# Altium schematic sheet V_Sns_I2C_Isolators.SchDoc
size B
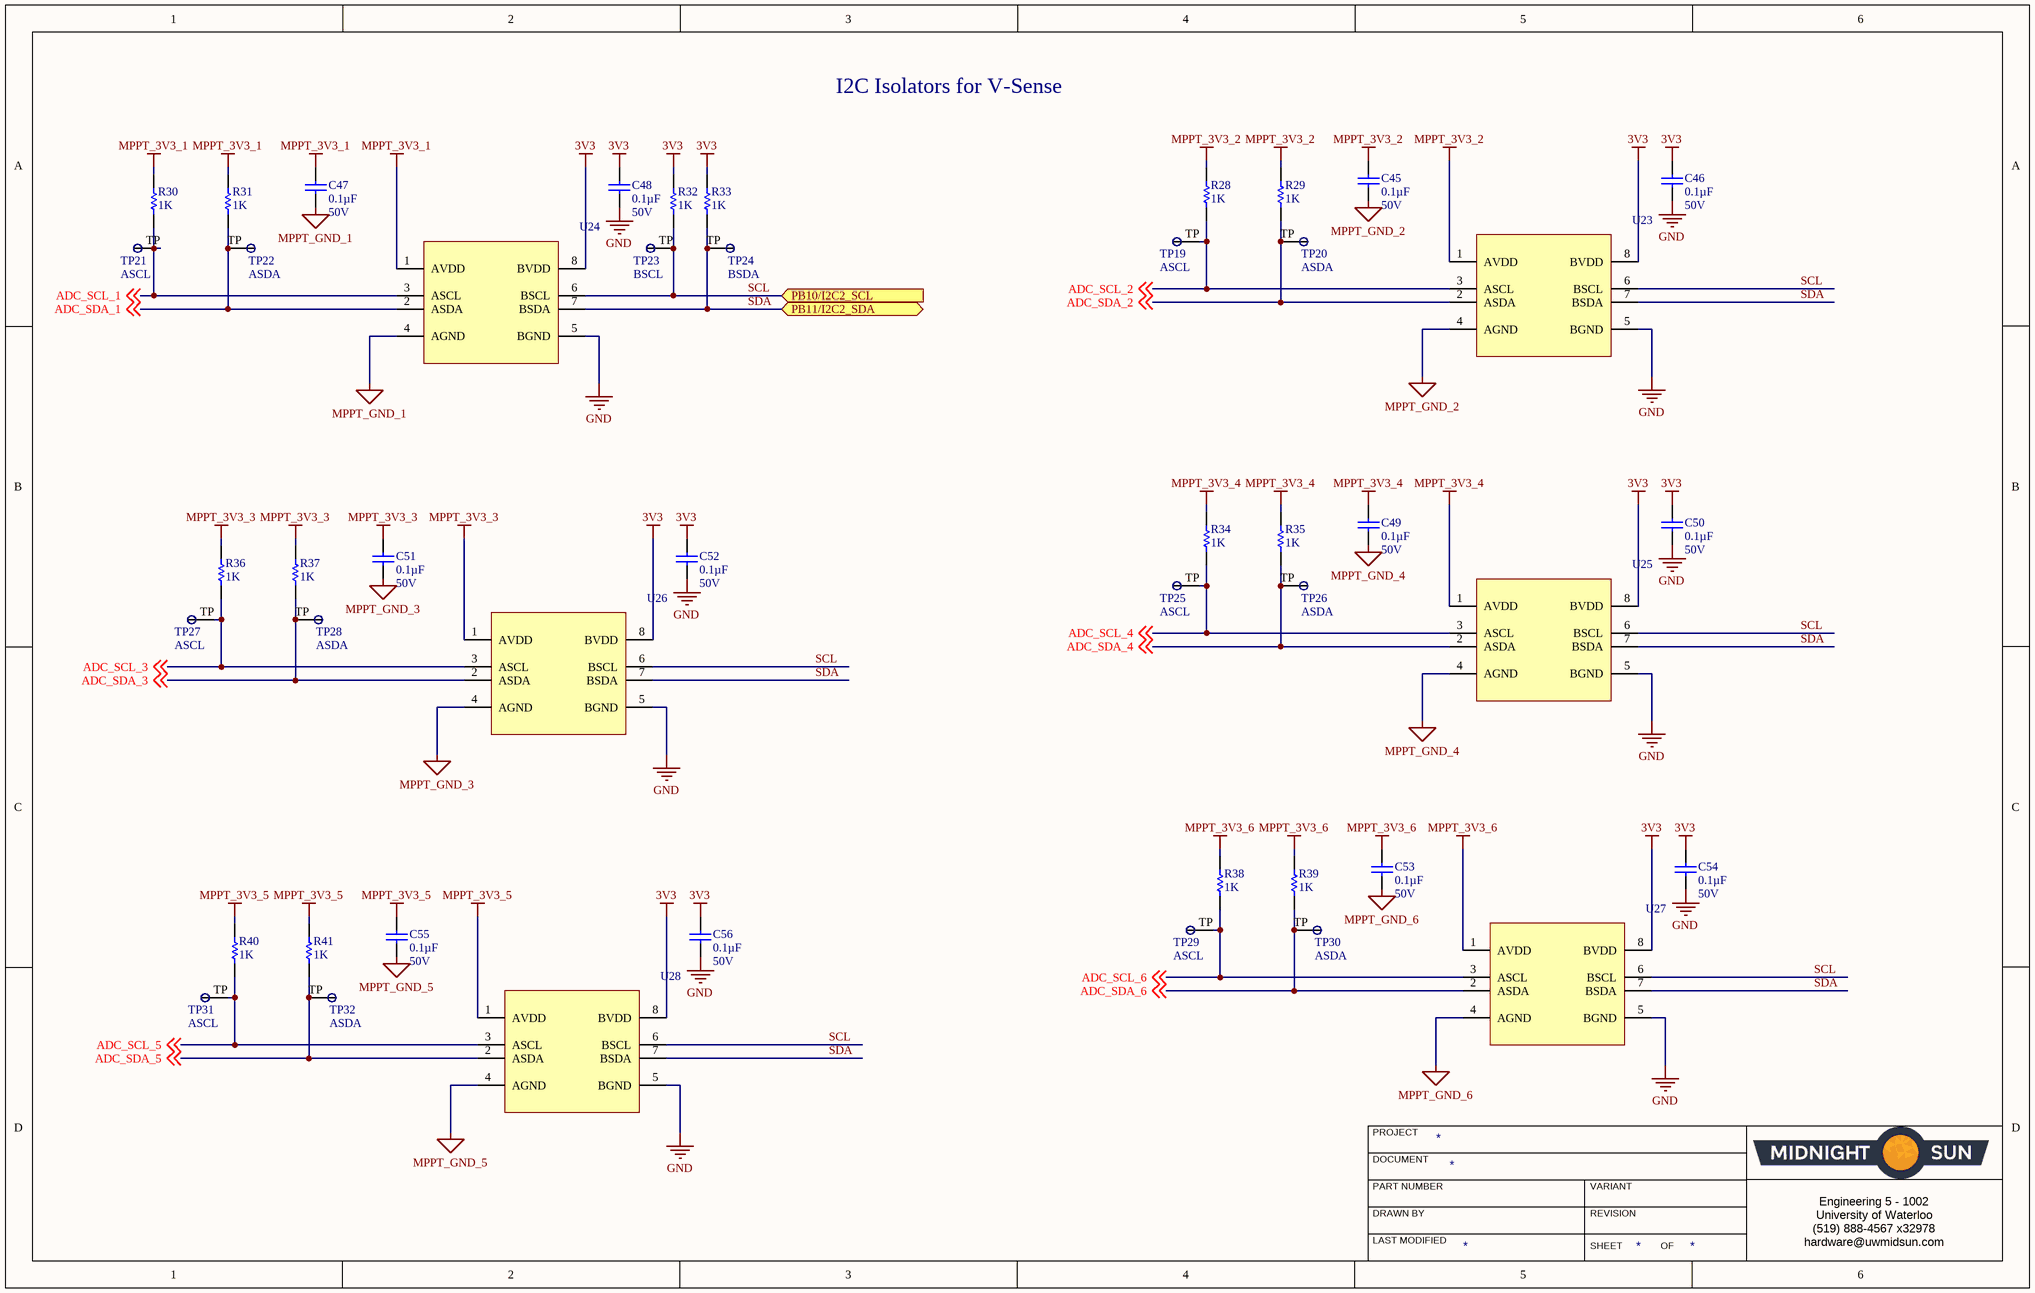
[diagram p0: V_Sns_I2C_Isolators.SchDoc]

## Parts
C45  Capacitance: 0.1µF  Voltage: 50V  [CAP, 0603]  (hidden comment: CAP CER 0.1UF 50V 10% X7R 0603)
C46  Capacitance: 0.1µF  Voltage: 50V  [CAP, 0603]  (hidden comment: CAP CER 0.1UF 50V 10% X7R 0603)
C47  Capacitance: 0.1µF  Voltage: 50V  [CAP, 0603]  (hidden comment: CAP CER 0.1UF 50V 10% X7R 0603)
C48  Capacitance: 0.1µF  Voltage: 50V  [CAP, 0603]  (hidden comment: CAP CER 0.1UF 50V 10% X7R 0603)
C49  Capacitance: 0.1µF  Voltage: 50V  [CAP, 0603]  (hidden comment: CAP CER 0.1UF 50V 10% X7R 0603)
C50  Capacitance: 0.1µF  Voltage: 50V  [CAP, 0603]  (hidden comment: CAP CER 0.1UF 50V 10% X7R 0603)
C51  Capacitance: 0.1µF  Voltage: 50V  [CAP, 0603]  (hidden comment: CAP CER 0.1UF 50V 10% X7R 0603)
C52  Capacitance: 0.1µF  Voltage: 50V  [CAP, 0603]  (hidden comment: CAP CER 0.1UF 50V 10% X7R 0603)
C53  Capacitance: 0.1µF  Voltage: 50V  [CAP, 0603]  (hidden comment: CAP CER 0.1UF 50V 10% X7R 0603)
C54  Capacitance: 0.1µF  Voltage: 50V  [CAP, 0603]  (hidden comment: CAP CER 0.1UF 50V 10% X7R 0603)
C55  Capacitance: 0.1µF  Voltage: 50V  [CAP, 0603]  (hidden comment: CAP CER 0.1UF 50V 10% X7R 0603)
C56  Capacitance: 0.1µF  Voltage: 50V  [CAP, 0603]  (hidden comment: CAP CER 0.1UF 50V 10% X7R 0603)
R28  1K  [RES, 0603]
R29  1K  [RES, 0603]
R30  1K  [RES, 0603]
R31  1K  [RES, 0603]
R32  1K  [RES, 0603]
R33  1K  [RES, 0603]
R34  1K  [RES, 0603]
R35  1K  [RES, 0603]
R36  1K  [RES, 0603]
R37  1K  [RES, 0603]
R38  1K  [RES, 0603]
R39  1K  [RES, 0603]
R40  1K  [RES, 0603]
R41  1K  [RES, 0603]
TP19  ASCL  [Test Point]  (no BOM)
TP20  ASDA  [Test Point]  (no BOM)
TP21  ASCL  [Test Point]  (no BOM)
TP22  ASDA  [Test Point]  (no BOM)
TP23  BSCL  [Test Point]  (no BOM)
TP24  BSDA  [Test Point]  (no BOM)
TP25  ASCL  [Test Point]  (no BOM)
TP26  ASDA  [Test Point]  (no BOM)
TP27  ASCL  [Test Point]  (no BOM)
TP28  ASDA  [Test Point]  (no BOM)
TP29  ASCL  [Test Point]  (no BOM)
TP30  ASDA  [Test Point]  (no BOM)
TP31  ASCL  [Test Point]  (no BOM)
TP32  ASDA  [Test Point]  (no BOM)
U23  IC DGTL ISO 2.5KV 2CH I2C 8SOIC ISO1540DR  [SOIC-8 ISO1540DR]  (value not drawn)
U24  IC DGTL ISO 2.5KV 2CH I2C 8SOIC ISO1540DR  [SOIC-8 ISO1540DR]  (value not drawn)
U25  IC DGTL ISO 2.5KV 2CH I2C 8SOIC ISO1540DR  [SOIC-8 ISO1540DR]  (value not drawn)
U26  IC DGTL ISO 2.5KV 2CH I2C 8SOIC ISO1540DR  [SOIC-8 ISO1540DR]  (value not drawn)
U27  IC DGTL ISO 2.5KV 2CH I2C 8SOIC ISO1540DR  [SOIC-8 ISO1540DR]  (value not drawn)
U28  IC DGTL ISO 2.5KV 2CH I2C 8SOIC ISO1540DR  [SOIC-8 ISO1540DR]  (value not drawn)

## Ports
PB10/I2C2_SCL (in), PB11/I2C2_SDA (bidir)

## Nets
3V3: C46.1 C48.1 C50.1 C52.1 C54.1 C56.1 R32.1 R33.1 U23.8(BVDD) U24.8(BVDD) U25.8(BVDD) U26.8(BVDD) U27.8(BVDD) U28.8(BVDD)
GND: C46.2 C48.2 C50.2 C52.2 C54.2 C56.2 U23.5(BGND) U24.5(BGND) U25.5(BGND) U26.5(BGND) U27.5(BGND) U28.5(BGND)
MPPT_3V3_1: C47.1 R30.1 R31.1 U24.1(AVDD)
MPPT_3V3_2: C45.1 R28.1 R29.1 U23.1(AVDD)
MPPT_3V3_3: C51.1 R36.1 R37.1 U26.1(AVDD)
MPPT_3V3_4: C49.1 R34.1 R35.1 U25.1(AVDD)
MPPT_3V3_5: C55.1 R40.1 R41.1 U28.1(AVDD)
MPPT_3V3_6: C53.1 R38.1 R39.1 U27.1(AVDD)
MPPT_GND_1: C47.2 U24.4(AGND)
MPPT_GND_2: C45.2 U23.4(AGND)
MPPT_GND_3: C51.2 U26.4(AGND)
MPPT_GND_4: C49.2 U25.4(AGND)
MPPT_GND_5: C55.2 U28.4(AGND)
MPPT_GND_6: C53.2 U27.4(AGND)
ADC_SCL_1: R30.2 TP21.TP U24.3(ASCL) ; off-sheet ADC_SCL_1
ADC_SCL_2: R28.2 TP19.TP U23.3(ASCL) ; off-sheet ADC_SCL_2
ADC_SCL_3: R36.2 TP27.TP U26.3(ASCL) ; off-sheet ADC_SCL_3
ADC_SCL_4: R34.2 TP25.TP U25.3(ASCL) ; off-sheet ADC_SCL_4
ADC_SCL_5: R40.2 TP31.TP U28.3(ASCL) ; off-sheet ADC_SCL_5
ADC_SCL_6: R38.2 TP29.TP U27.3(ASCL) ; off-sheet ADC_SCL_6
ADC_SDA_1: R31.2 TP22.TP U24.2(ASDA) ; off-sheet ADC_SDA_1
ADC_SDA_2: R29.2 TP20.TP U23.2(ASDA) ; off-sheet ADC_SDA_2
ADC_SDA_3: R37.2 TP28.TP U26.2(ASDA) ; off-sheet ADC_SDA_3
ADC_SDA_4: R35.2 TP26.TP U25.2(ASDA) ; off-sheet ADC_SDA_4
ADC_SDA_5: R41.2 TP32.TP U28.2(ASDA) ; off-sheet ADC_SDA_5
ADC_SDA_6: R39.2 TP30.TP U27.2(ASDA) ; off-sheet ADC_SDA_6
SCL: R32.2 TP23.TP U23.6(BSCL) U24.6(BSCL) U25.6(BSCL) U26.6(BSCL) U27.6(BSCL) U28.6(BSCL) ; port PB10/I2C2_SCL
SDA: R33.2 TP24.TP U23.7(BSDA) U24.7(BSDA) U25.7(BSDA) U26.7(BSDA) U27.7(BSDA) U28.7(BSDA) ; port PB11/I2C2_SDA

## Notes on the sheet
- I2C Isolators for V-Sense
- PROJECT
- DOCUMENT
- DRAWN BY
- LAST MODIFIED
- PART NUMBER
- REVISION
- SHEET
- VARIANT
- OF
- Engineering 5 - 1002
  University of Waterloo
  (519) 888-4567 x32978
  hardware@uwmidsun.com

## Library data of the parts
C45-C56 = CAP CER 0.1UF 50V 10% X7R 0603: 0.10µF ±10% 50V Ceramic Capacitor X7R 0603 (1608 Metric); Manufacturer 1: AVX Corporation; Manufacturer Part Number 1: 06035C104KAT2A; Supplier 1: Digi-Key; Supplier Part Number 1: 478-5052-1-ND; Packaging: Cut Tape (CT); Part Status: Active; Operating Temperature: -55°C ~ 125°C; Ratings: -; Mounting Type: Surface Mount, MLCC; Package / Case: 0603 (1608 Metric); Size / Dimension: 0.063" L x 0.032" W (1.60mm x 0.81mm); Height - Seated (Max): -; Thickness (Max): 0.035" (0.90mm); Lead Spacing: -; Lead Style: -; ComponentLink1URL: http://datasheets.avx.com/X7RDielectric.pdf; ComponentLink1Description: http://datasheets.avx.com/X7RDielectric.pdf; Tolerance: ±10%; Temperature Coefficient: X7R
R28-R41 = RES 1K OHM 5% 1/10W 0603: 1k Ohm ±5% 0.1W, 1/10W Chip Resistor 0603 (1608 Metric); Manufacturer: Yageo; Manufacturer Part Number: RC0603JR-071KL; Temperature Coefficient: ±100ppm/°C; Supplier 1: Digi-Key; Supplier Part Number 1: 311-1.0KGRCT-ND; RoHS: RoHS Compliant; Category: Resistors; Stock 1: 4415240; Pricing 1: 1=0.15, 10=0.017, 100=0.0071, 1000=0.0032, 2500=0.00278 (CAD); Packaging: Cut Tape (CT); Part Status: Active; Resistance (Ohms): 1k; Tolerance: ±5%; Power (Watts): 0.1W, 1/10W; Composition: Thick Film; Features: Moisture Resistant; Operating Temperature: -55°C ~ 155°C; Package / Case: 0603 (1608 Metric); Supplier Device Package: 0603; Size / Dimension: 0.063" L x 0.031" W (1.60mm x 0.80mm); Height - Seated (Max): 0.022" (0.55mm); Failure Rate: -; ComponentLink1URL: http://www.yageo.com/documents/recent/PYu-RC_Group_51_RoHS_L_7.pdf; ComponentLink1Description: http://www.yageo.com/documents/recent/PYu-RC_Group_51_RoHS_L_7.pdf
TP19-TP32 = Test Point
U23-U28 = IC DGTL ISO 2.5KV 2CH I2C 8SOIC ISO1540DR: I²C Digital Isolator 2500Vrms 2 Channel 1Mbps 25kV/µs CMTI 8-SOIC (0.154", 3.90mm Width); Manufacturer: Texas Instruments; Number of Channels: 2; Propagation Delay: 70ns; Channel Type: Bidirectional; Isolated Power: No; Pulse Width Distortion (PWD): 21ns; Min Supply Voltage: 3V; Max Supply Voltage: 5.5V; Nominal Supply Current: 3.6mA; Working Voltage: 566V; Supplier 1: Digi-Key; Supplier Part Number 1: 296-34871-1-ND; Stock 1: 10427; Pricing 1: 1=4.80000, 10=4.31400, 25=4.07880, 100=3.35370, 250=3.00924, 500=2.90048, 1000=2.41102 (USD); Case/Package: SOIC; Number of Pins: 8; Min Operating Temperature: -40°C; Max Operating Temperature: 125°C; Package Quantity: 1; Packaging: Tape and Reel; Data Rate: 1Mbps; ComponentLink1URL: https://datasheet.ciiva.com/6579/iso1540-6579723.pdf?src-supplier=Digi-Key; ComponentLink1Description: https://datasheet.ciiva.com/6579/iso1540-6579723.pdf?src-supplier=Digi-Key; Manufacturer Part Number: ISO1540DR; RoHS: Yes; Category: Interface ICs; Mount: Surface Mount; REACH SVHC: No SVHC; Lead Free: Lead Free; ComponentLink2URL: https://datasheet.ciiva.com/6579/iso1540-6579724.pdf?src-supplier=Digi-Key; ComponentLink2Description: https://datasheet.ciiva.com/6579/iso1540-6579724.pdf?src-supplier=Digi-Key; ComponentLink3URL: https://datasheet.ciiva.com/6579/iso1540-6579725.pdf?src-supplier=Digi-Key; ComponentLink3Description: https://datasheet.ciiva.com/6579/iso1540-6579725.pdf?src-supplier=Digi-Key; ComponentLink4URL: https://datasheet.ciiva.com/14196/iso1540-14196749.pdf?src-supplier=Avnet; ComponentLink4Description: https://datasheet.ciiva.com/14196/iso1540-14196749.pdf?src-supplier=Avnet